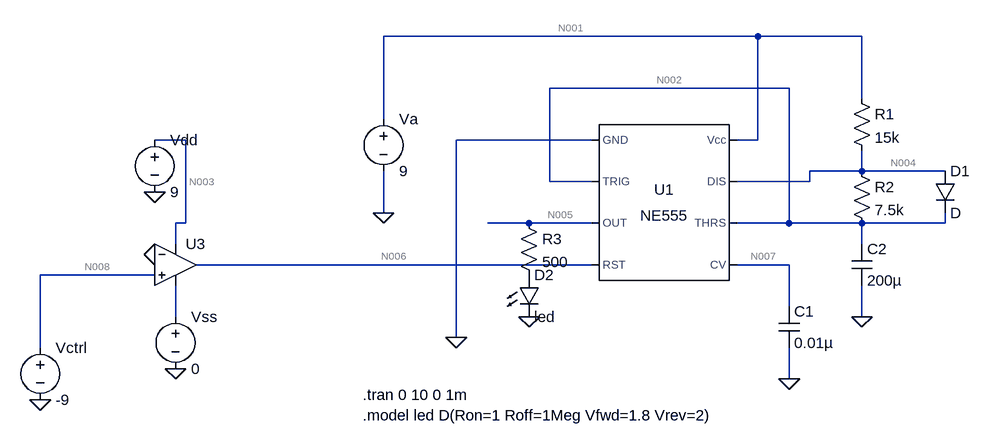
[diagram p0: schematic progetto_timer555.asc]
progetto_timer555.asc, the LTspice schematic file:
Version 4
SHEET 1 880 680
WIRE 432 -208 -144 -208
WIRE 592 -208 432 -208
WIRE 480 -128 112 -128
WIRE 592 -112 592 -208
WIRE -144 -80 -144 -208
WIRE -448 -48 -496 -48
WIRE 176 -48 -32 -48
WIRE 432 -48 432 -208
WIRE 432 -48 400 -48
WIRE 592 0 592 -32
WIRE 592 0 512 0
WIRE 720 0 592 0
WIRE 112 16 112 -128
WIRE 176 16 112 16
WIRE 512 16 512 0
WIRE 512 16 400 16
WIRE -144 64 -144 0
WIRE -448 80 -448 -48
WIRE -448 80 -464 80
WIRE 80 80 16 80
WIRE 176 80 80 80
WIRE 480 80 480 -128
WIRE 480 80 400 80
WIRE 592 80 480 80
WIRE 720 80 720 64
WIRE 720 80 592 80
WIRE -464 112 -464 80
WIRE 592 112 592 80
WIRE 176 144 -432 144
WIRE 480 144 400 144
WIRE -496 160 -672 160
WIRE 480 208 480 144
WIRE -464 224 -464 176
WIRE 592 224 592 176
WIRE -32 256 -32 -48
WIRE -672 272 -672 160
WIRE 480 320 480 272
FLAG -32 256 0
FLAG -144 64 0
FLAG 480 320 0
FLAG 592 224 0
FLAG -672 352 0
FLAG -464 304 0
FLAG -496 32 0
FLAG -496 128 0
FLAG 80 224 0
SYMBOL Misc\\NE555 288 48 R0
SYMATTR InstName U1
SYMBOL voltage -144 -96 R0
WINDOW 123 0 0 Left 0
WINDOW 39 0 0 Left 0
SYMATTR InstName Va
SYMATTR Value 9
SYMBOL cap 464 208 R0
SYMATTR InstName C1
SYMATTR Value 0.01µ
SYMBOL res 576 -16 R0
SYMATTR InstName R2
SYMATTR Value 7.5k
SYMBOL res 576 -128 R0
SYMATTR InstName R1
SYMATTR Value 15k
SYMBOL cap 576 112 R0
SYMATTR InstName C2
SYMATTR Value 200µ
SYMBOL diode 704 0 R0
SYMATTR InstName D1
SYMBOL voltage -672 256 R0
WINDOW 123 0 0 Left 0
WINDOW 39 0 0 Left 0
SYMATTR InstName Vctrl
SYMATTR Value -9
SYMBOL voltage -496 -64 R0
WINDOW 123 0 0 Left 0
WINDOW 39 0 0 Left 0
SYMATTR InstName Vdd
SYMATTR Value 9
SYMBOL voltage -464 208 R0
WINDOW 123 0 0 Left 0
WINDOW 39 0 0 Left 0
SYMATTR InstName Vss
SYMATTR Value 0
SYMBOL OpAmps\\UniversalOpAmp2 -464 144 R0
SYMATTR InstName U3
SYMBOL res 64 64 R0
SYMATTR InstName R3
SYMATTR Value 500
SYMBOL LED 64 160 R0
SYMATTR InstName D2
SYMATTR Value led
TEXT -176 344 Left 2 !.tran 0 10 0 1m
TEXT -176 376 Left 2 !.model led D(Ron=1 Roff=1Meg Vfwd=1.8 Vrev=2)

The netlist it stands for:
* progetto_timer555.asc
XU1 0 N002 N005 N006 N007 N002 N004 N001 NE555  ; pins GND TRIG OUT RST CV THRS DIS Vcc
Va N001 0 9
C1 N007 0 0.01µ
R2 N004 N002 7.5k
R1 N001 N004 15k
C2 N002 0 200µ
D1 N004 N002 D
Vctrl N008 0 -9
Vdd N003 0 9
Vss N009 0 0
XU3 N008 0 N003 N009 N006 level2 Avol=1Meg GBW=10Meg Slew=10Meg Ilimit=25m Rail=0 Vos=0 En=0 Enk=0 In=0 Ink=0 Rin=500Meg  ; pins In+ In- V+ V- OUT
R3 N005 P001 500
D2 P001 0 led
.model D D
.lib standard.dio
.tran 0 10 0 1m
.model led D(Ron=1 Roff=1Meg Vfwd=1.8 Vrev=2)
.lib NE555.sub
.lib UniversalOpAmp2.lib
.backanno
.end

* Results of the author's LTspice run, read from the files saved beside the schematic
* Operating Point, zero values left out:
*   V(n002) = 3.599 mV
*   V(n007) = 6 V
*   V(n001) = 9 V
*   V(n004) = 3.599 mV
*   V(n005) = 54 µV
*   V(n006) = 4.153 mV
*   V(n008) = -9 V
*   V(n003) = 9 V
*   V(p001) = 53.97 µV
*   I(D2) = 53.97 pA
*   I(R3) = 53.97 pA
*   I(R1) = 599.8 µA
*   I(R2) = 7.197 pA
*   I(Vss) = 400.9 µA
*   I(Vdd) = -1.066 µA
*   I(Vctrl) = 27 nA
*   I(Va) = -3.859 mA
*   Ix(u1:1) = -3.459 mA
*   Ix(u1:2) = 3.599 pA
*   Ix(u1:3) = -53.97 pA
*   Ix(u1:4) = -400 µA
*   Ix(u1:6) = 3.599 pA
*   Ix(u1:7) = 599.8 µA
*   Ix(u1:8) = 3.259 mA
*   Ix(u3:1) = -27 nA
*   Ix(u3:2) = -9 nA
*   Ix(u3:3) = 1.066 µA
*   Ix(u3:4) = -400.9 µA
*   Ix(u3:5) = 400 µA